# Altium schematic sheet 07_DDR3.SchDoc
size 420 x 297 mm
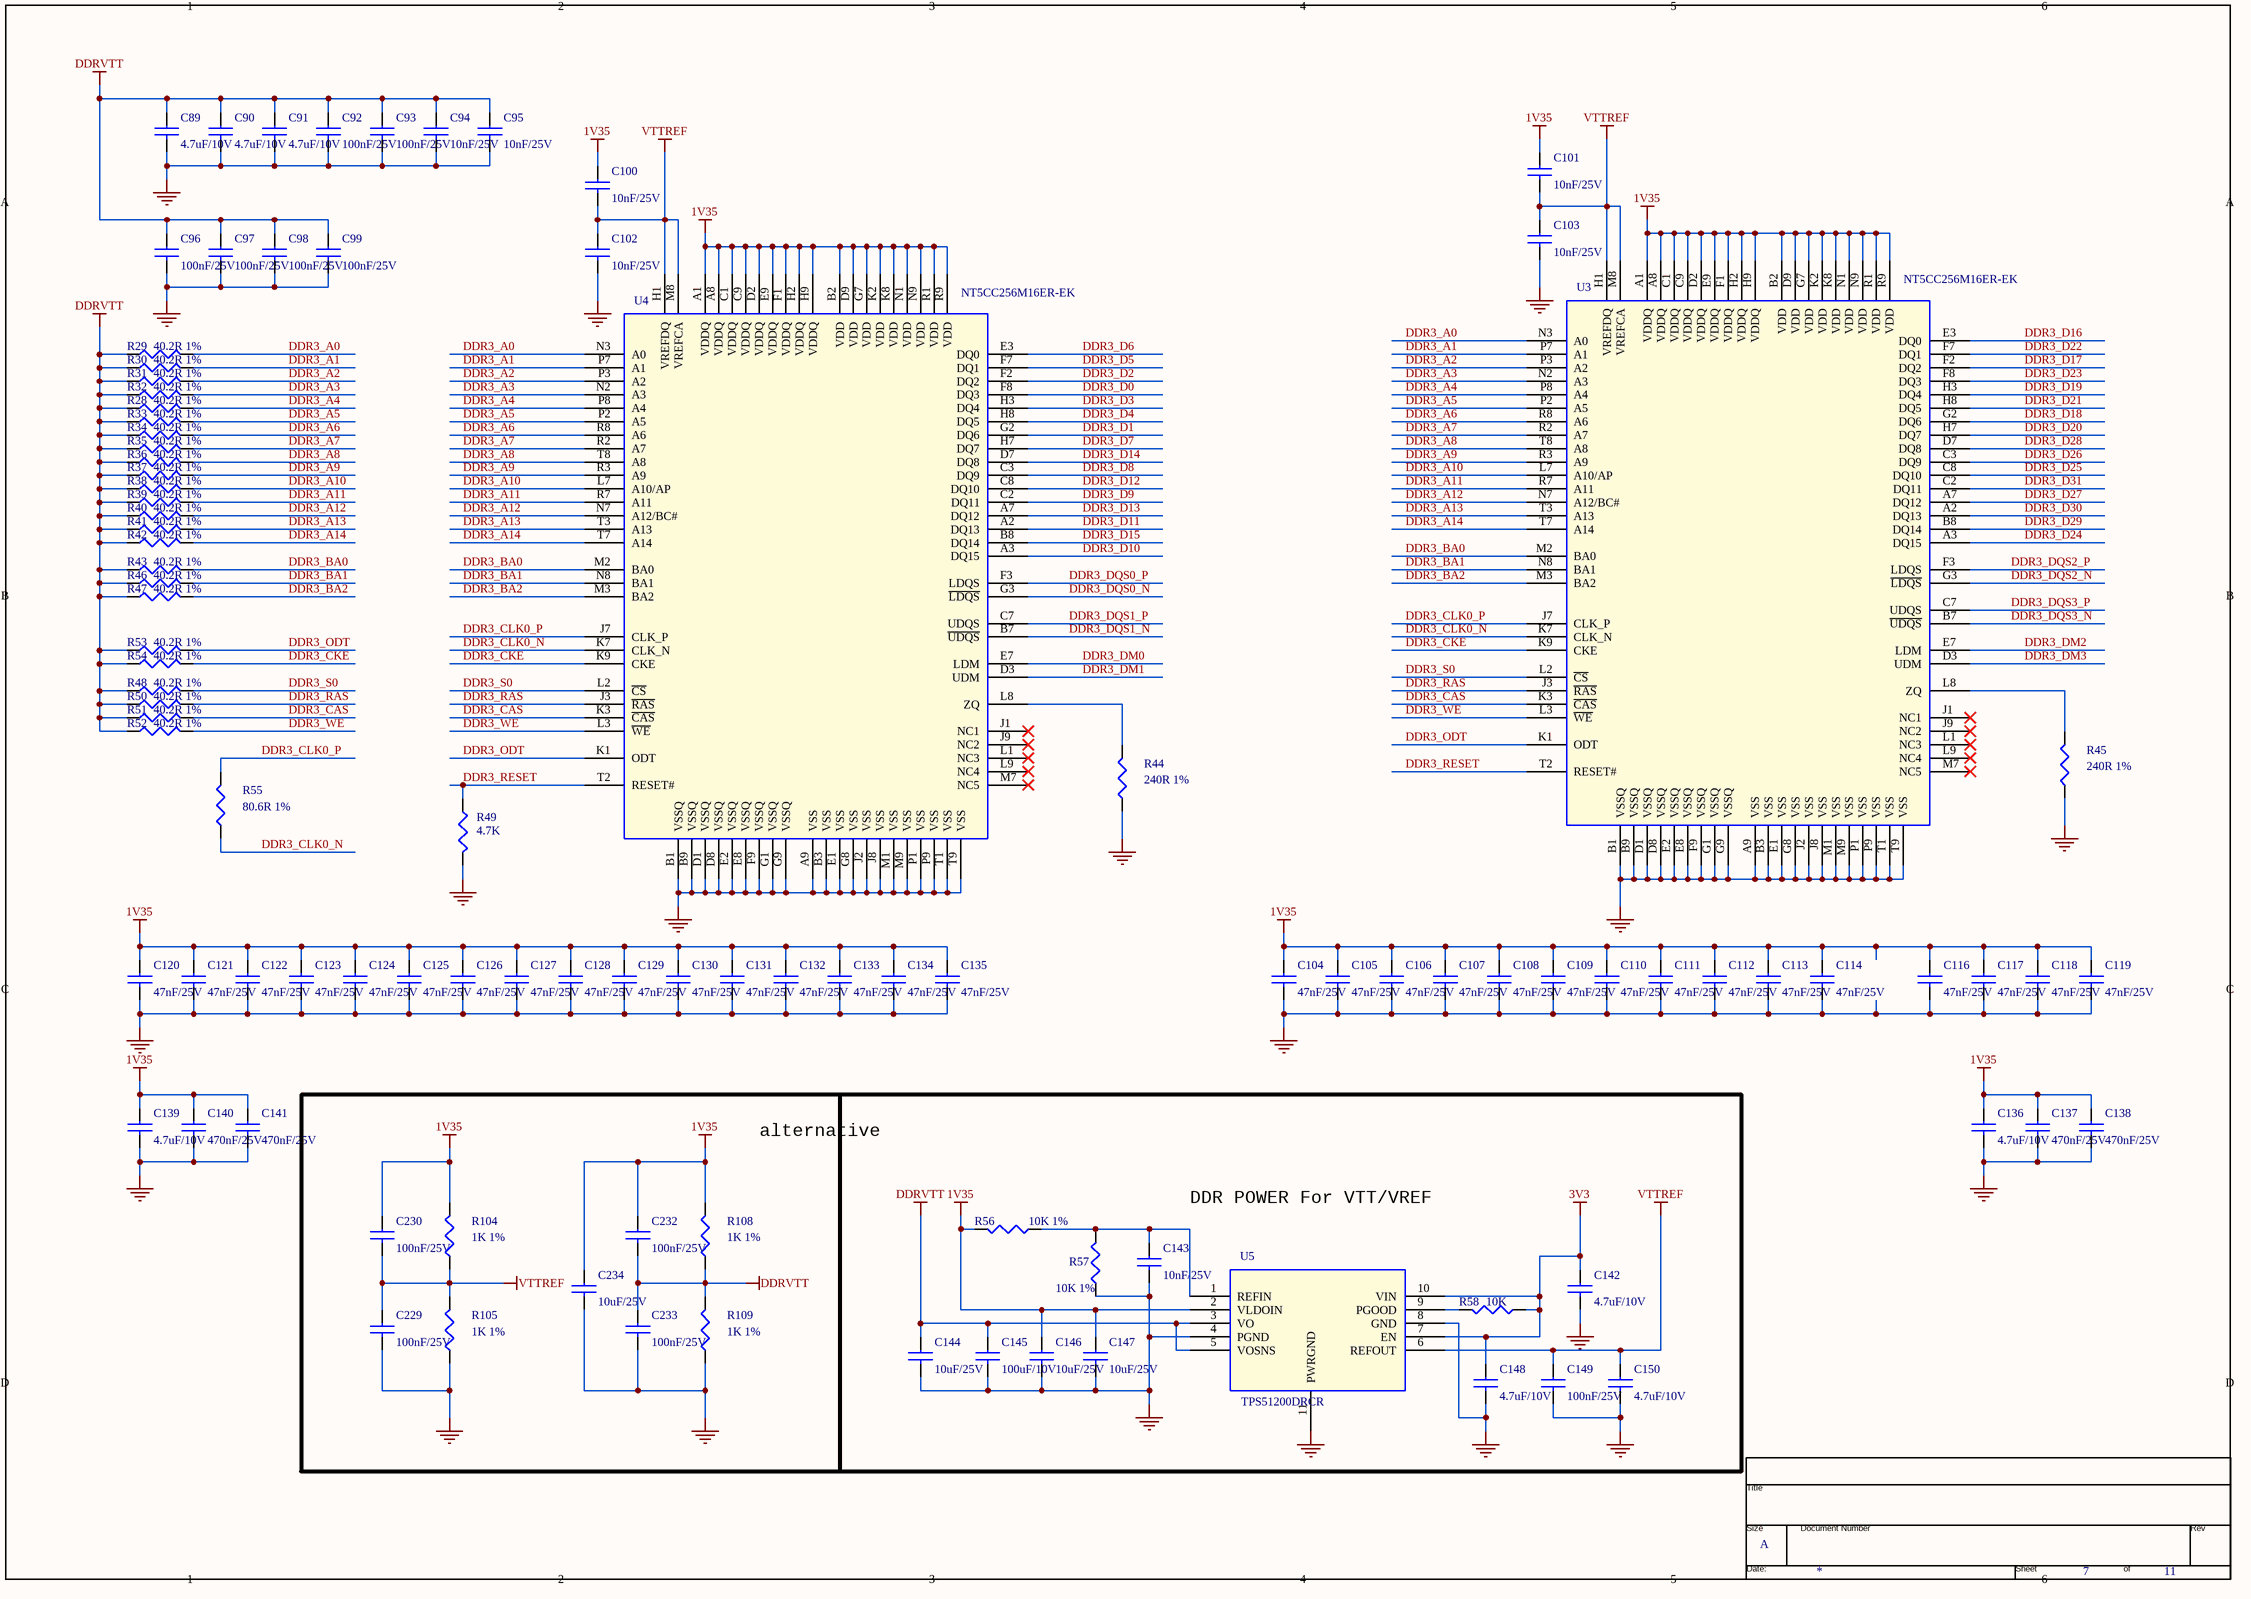
[diagram p0: 07_DDR3.SchDoc]

## Parts
*  Page Count: 11  Page Number: 7  Page Size: A  (hidden comment: TitleBlock0)  (graphical)
C89  4.7uF/10V  [C0402]
C90  4.7uF/10V  [C0402]
C91  4.7uF/10V  [C0402]
C92  100nF/25V  [C0402]
C93  100nF/25V  [C0402]
C94  10nF/25V  [C0402]
C95  10nF/25V  [C0402]
C96  100nF/25V  [C0402]
C97  100nF/25V  [C0402]
C98  100nF/25V  [C0402]
C99  100nF/25V  [C0402]
C100  10nF/25V  [C0402]
C101  10nF/25V  [C0402]
C102  10nF/25V  [C0402]
C103  10nF/25V  [C0402]
C104  47nF/25V  [C0402]
C105  47nF/25V  [C0402]
C106  47nF/25V  [C0402]
C107  47nF/25V  [C0402]
C108  47nF/25V  [C0402]
C109  47nF/25V  [C0402]
C110  47nF/25V  [C0402]
C111  47nF/25V  [C0402]
C112  47nF/25V  [C0402]
C113  47nF/25V  [C0402]
C114  47nF/25V  [C0402]
C116  47nF/25V  [C0402]
C117  47nF/25V  [C0402]
C118  47nF/25V  [C0402]
C119  47nF/25V  [C0402]
C120  47nF/25V  [C0402]
C121  47nF/25V  [C0402]
C122  47nF/25V  [C0402]
C123  47nF/25V  [C0402]
C124  47nF/25V  [C0402]
C125  47nF/25V  [C0402]
C126  47nF/25V  [C0402]
C127  47nF/25V  [C0402]
C128  47nF/25V  [C0402]
C129  47nF/25V  [C0402]
C130  47nF/25V  [C0402]
C131  47nF/25V  [C0402]
C132  47nF/25V  [C0402]
C133  47nF/25V  [C0402]
C134  47nF/25V  [C0402]
C135  47nF/25V  [C0402]
C136  4.7uF/10V  [C0402]
C137  470nF/25V  [C0402]
C138  470nF/25V  [C0402]
C139  4.7uF/10V  [C0402]
C140  470nF/25V  [C0402]
C141  470nF/25V  [C0402]
C142  4.7uF/10V  [C0402]
C143  10nF/25V  [C0402]
C144  10uF/25V  [C0603]
C145  100uF/10V  [1206C-N]
C146  10uF/25V  [C0603]
C147  10uF/25V  [C0603]
C148  4.7uF/10V  [C0402]
C149  100nF/25V  [C0402]
C150  4.7uF/10V  [C0402]
C229  100nF/25V  [C0402]
C230  100nF/25V  [C0402]
C232  100nF/25V  [C0402]
C233  100nF/25V  [C0402]
C234  10uF/25V  [C0603]
R28  40.2R 1%  [R0402]
R29  40.2R 1%  [R0402]
R30  40.2R 1%  [R0402]
R31  40.2R 1%  [R0402]
R32  40.2R 1%  [R0402]
R33  40.2R 1%  [R0402]
R34  40.2R 1%  [R0402]
R35  40.2R 1%  [R0402]
R36  40.2R 1%  [R0402]
R37  40.2R 1%  [R0402]
R38  40.2R 1%  [R0402]
R39  40.2R 1%  [R0402]
R40  40.2R 1%  [R0402]
R41  40.2R 1%  [R0402]
R42  40.2R 1%  [R0402]
R43  40.2R 1%  [R0402]
R44  240R 1%  [R0402]
R45  240R 1%  [R0402]
R46  40.2R 1%  [R0402]
R47  40.2R 1%  [R0402]
R48  40.2R 1%  [R0402]
R49  4.7K  [R0402]
R50  40.2R 1%  [R0402]
R51  40.2R 1%  [R0402]
R52  40.2R 1%  [R0402]
R53  40.2R 1%  [R0402]
R54  40.2R 1%  [R0402]
R55  80.6R 1%  [R0402]
R56  10K 1%  [R0402]
R57  10K 1%  [R0402]
R58  10K  [R0402]
R104  1K 1%  [R0402]
R105  1K 1%  [R0402]
R108  1K 1%  [R0603]
R109  1K 1%  [R0603]
U3  NT5CC256M16ER-EK  [FBGA_96]
U4  NT5CC256M16ER-EK  [FBGA_96]
U5  TPS51200DRCR  [TPS_QFN10]

## Nets
1V35: C100.1 C101.1 C104.1 C105.1 C106.1 C107.1 C108.1 C109.1 C110.1 C111.1 C112.1 C113.1 C114.1 C116.1 C117.1 C118.1 C119.1 C120.1 C121.1 C122.1 C123.1 C124.1 C125.1 C126.1 C127.1 C128.1 C129.1 C130.1 C131.1 C132.1 C133.1 C134.1 C135.1 C136.1 C137.1 C138.1 C139.1 C140.1 C141.1 C146.1 C147.1 C230.1 C232.1 C234.1 R56.2 R104.2 R108.2 U3.A1(VDDQ) U3.A8(VDDQ) U3.B2(VDD) U3.C1(VDDQ) U3.C9(VDDQ) U3.D2(VDDQ) U3.D9(VDD) U3.E9(VDDQ) U3.F1(VDDQ) U3.G7(VDD) U3.H2(VDDQ) U3.H9(VDDQ) U3.K2(VDD) U3.K8(VDD) U3.N1(VDD) U3.N9(VDD) U3.R1(VDD) U3.R9(VDD) U4.A1(VDDQ) U4.A8(VDDQ) U4.B2(VDD) U4.C1(VDDQ) U4.C9(VDDQ) U4.D2(VDDQ) U4.D9(VDD) U4.E9(VDDQ) U4.F1(VDDQ) U4.G7(VDD) U4.H2(VDDQ) U4.H9(VDDQ) U4.K2(VDD) U4.K8(VDD) U4.N1(VDD) U4.N9(VDD) U4.R1(VDD) U4.R9(VDD) U5.2(VLDOIN)
3V3: C142.1 C148.1 R58.1 U5.7(EN) U5.10(VIN)
DDRVTT: C89.1 C90.1 C91.1 C92.1 C93.1 C94.1 C95.1 C96.1 C97.1 C98.1 C99.1 C144.1 C145.1 C232.2 C233.1 R28.1 R29.1 R30.1 R31.1 R32.1 R33.1 R34.1 R35.1 R36.1 R37.1 R38.1 R39.1 R40.1 R41.1 R42.1 R43.1 R46.1 R47.1 R48.1 R50.1 R51.1 R52.1 R53.1 R54.1 R108.1 R109.2 U5.3(VO) U5.5(VOSNS)
GND: C89.2 C90.2 C91.2 C92.2 C93.2 C94.2 C95.2 C96.2 C97.2 C98.2 C99.2 C102.2 C103.2 C104.2 C105.2 C106.2 C107.2 C108.2 C109.2 C110.2 C111.2 C112.2 C113.2 C114.2 C116.2 C117.2 C118.2 C119.2 C120.2 C121.2 C122.2 C123.2 C124.2 C125.2 C126.2 C127.2 C128.2 C129.2 C130.2 C131.2 C132.2 C133.2 C134.2 C135.2 C136.2 C137.2 C138.2 C139.2 C140.2 C141.2 C142.2 C143.2 C144.2 C145.2 C146.2 C147.2 C148.2 C149.2 C150.2 C229.2 C233.2 C234.2 R44.1 R45.1 R49.2 R57.1 R105.1 R109.1 U3.A9(VSS) U3.B1(VSSQ) U3.B3(VSS) U3.B9(VSSQ) U3.D1(VSSQ) U3.D8(VSSQ) U3.E1(VSS) U3.E2(VSSQ) U3.E8(VSSQ) U3.F9(VSSQ) U3.G1(VSSQ) U3.G8(VSS) U3.G9(VSSQ) U3.J2(VSS) U3.J8(VSS) U3.M1(VSS) U3.M9(VSS) U3.P1(VSS) U3.P9(VSS) U3.T1(VSS) U3.T9(VSS) U4.A9(VSS) U4.B1(VSSQ) U4.B3(VSS) U4.B9(VSSQ) U4.D1(VSSQ) U4.D8(VSSQ) U4.E1(VSS) U4.E2(VSSQ) U4.E8(VSSQ) U4.F9(VSSQ) U4.G1(VSSQ) U4.G8(VSS) U4.G9(VSSQ) U4.J2(VSS) U4.J8(VSS) U4.M1(VSS) U4.M9(VSS) U4.P1(VSS) U4.P9(VSS) U4.T1(VSS) U4.T9(VSS) U5.4(PGND) U5.8(GND) U5.11(PWRGND)
VTTREF: C100.2 C101.2 C102.1 C103.1 C149.1 C150.1 C229.1 C230.2 R104.1 R105.2 U3.H1(VREFDQ) U3.M8(VREFCA) U4.H1(VREFDQ) U4.M8(VREFCA) U5.6(REFOUT)
DDR3_A0: R29.2 U3.N3(A0) U4.N3(A0)
DDR3_A1: R30.2 U3.P7(A1) U4.P7(A1)
DDR3_A2: R31.2 U3.P3(A2) U4.P3(A2)
DDR3_A3: R32.2 U3.N2(A3) U4.N2(A3)
DDR3_A4: R28.2 U3.P8(A4) U4.P8(A4)
DDR3_A5: R33.2 U3.P2(A5) U4.P2(A5)
DDR3_A6: R34.2 U3.R8(A6) U4.R8(A6)
DDR3_A7: R35.2 U3.R2(A7) U4.R2(A7)
DDR3_A8: R36.2 U3.T8(A8) U4.T8(A8)
DDR3_A9: R37.2 U3.R3(A9) U4.R3(A9)
DDR3_A10: R38.2 U3.L7(A10/AP) U4.L7(A10/AP)
DDR3_A11: R39.2 U3.R7(A11) U4.R7(A11)
DDR3_A12: R40.2 U3.N7(A12/BC#) U4.N7(A12/BC#)
DDR3_A13: R41.2 U3.T3(A13) U4.T3(A13)
DDR3_A14: R42.2 U3.T7(A14) U4.T7(A14)
DDR3_BA0: R43.2 U3.M2(BA0) U4.M2(BA0)
DDR3_BA1: R46.2 U3.N8(BA1) U4.N8(BA1)
DDR3_BA2: R47.2 U3.M3(BA2) U4.M3(BA2)
DDR3_CAS: R51.2 U3.K3(~{CAS}) U4.K3(~{CAS})
DDR3_CKE: R54.2 U3.K9(CKE) U4.K9(CKE)
DDR3_CLK0_N: R55.1 U3.K7(CLK_N) U4.K7(CLK_N)
DDR3_CLK0_P: R55.2 U3.J7(CLK_P) U4.J7(CLK_P)
DDR3_D0: U4.F8(DQ3)
DDR3_D1: U4.G2(DQ6)
DDR3_D2: U4.F2(DQ2)
DDR3_D3: U4.H3(DQ4)
DDR3_D4: U4.H8(DQ5)
DDR3_D5: U4.F7(DQ1)
DDR3_D6: U4.E3(DQ0)
DDR3_D7: U4.H7(DQ7)
DDR3_D8: U4.C3(DQ9)
DDR3_D9: U4.C2(DQ11)
DDR3_D10: U4.A3(DQ15)
DDR3_D11: U4.A2(DQ13)
DDR3_D12: U4.C8(DQ10)
DDR3_D13: U4.A7(DQ12)
DDR3_D14: U4.D7(DQ8)
DDR3_D15: U4.B8(DQ14)
DDR3_D16: U3.E3(DQ0)
DDR3_D17: U3.F2(DQ2)
DDR3_D18: U3.G2(DQ6)
DDR3_D19: U3.H3(DQ4)
DDR3_D20: U3.H7(DQ7)
DDR3_D21: U3.H8(DQ5)
DDR3_D22: U3.F7(DQ1)
DDR3_D23: U3.F8(DQ3)
DDR3_D24: U3.A3(DQ15)
DDR3_D25: U3.C8(DQ10)
DDR3_D26: U3.C3(DQ9)
DDR3_D27: U3.A7(DQ12)
DDR3_D28: U3.D7(DQ8)
DDR3_D29: U3.B8(DQ14)
DDR3_D30: U3.A2(DQ13)
DDR3_D31: U3.C2(DQ11)
DDR3_DM0: U4.E7(LDM)
DDR3_DM1: U4.D3(UDM)
DDR3_DM2: U3.E7(LDM)
DDR3_DM3: U3.D3(UDM)
DDR3_DQS0_N: U4.G3(~{LDQS})
DDR3_DQS0_P: U4.F3(LDQS)
DDR3_DQS1_N: U4.B7(~{UDQS})
DDR3_DQS1_P: U4.C7(UDQS)
DDR3_DQS2_N: U3.G3(~{LDQS})
DDR3_DQS2_P: U3.F3(LDQS)
DDR3_DQS3_N: U3.B7(~{UDQS})
DDR3_DQS3_P: U3.C7(UDQS)
DDR3_ODT: R53.2 U3.K1(ODT) U4.K1(ODT)
DDR3_RAS: R50.2 U3.J3(~{RAS}) U4.J3(~{RAS})
DDR3_RESET: R49.1 U3.T2(RESET#) U4.T2(RESET#)
DDR3_S0: R48.2 U3.L2(~{CS}) U4.L2(~{CS})
DDR3_WE: R52.2 U3.L3(~{WE}) U4.L3(~{WE})
NetC143_1: C143.1 R56.1 R57.2 U5.1(REFIN)
NetR44_2: R44.2 U4.L8(ZQ)
NetR45_2: R45.2 U3.L8(ZQ)
NetR58_2: R58.2 U5.9(PGOOD)

Not connected (* = marked no-connect by the designer): U3 J1(NC1)* J9(NC2)* L1(NC3)* L9(NC4)* M7(NC5)*; U4 J1(NC1)* J9(NC2)* L1(NC3)* L9(NC4)* M7(NC5)*

## Notes on the sheet
- alternative
- DDR POWER For VTT/VREF
- (in symbol TitleBlock0) Title; Size; Document Number; Rev; Date:; Sheet; of

## Library data of the parts
C89-C114 C116-C150 C229 C230 C232-C234 = CAP NP_Dup1
  C89-C114 C116-C143 C148-C150 C229 C230 C232 C233: PCB Footprint: C0402
  C144 C146 C147 C234: PCB Footprint: C0603
  C145: PCB Footprint: 1206C-N
R28-R58 R104 R105 = RESISTOR_Dup1: PCB Footprint: R0402
R108 R109 = RESISTOR_Dup1: 0603; PCB Footprint: R0603
U3 U4 = H5TQ4G63AFR-PBI: PCB Footprint: FBGA_96
* = TitleBlock0: Page Create Date: March  8, 1995; Page Modify Date: *
U5 = TPS51200DRCR: PCB Footprint: TPS_QFN10